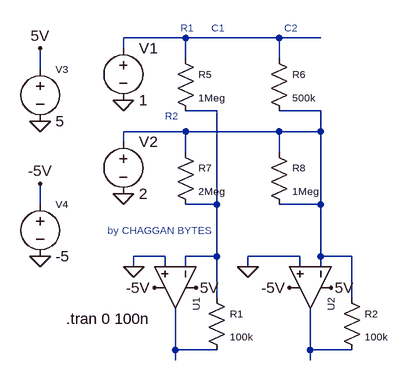
[diagram p0: schematic PIM_spice.asc]
PIM_spice.asc, the LTspice schematic file:
Version 4.1
SHEET 1 880 680
WIRE 480 48 384 48
WIRE 624 48 480 48
WIRE 688 48 624 48
WIRE 384 64 384 48
WIRE 480 80 480 48
WIRE 624 80 624 48
WIRE 256 96 256 64
WIRE 528 160 480 160
WIRE 688 160 624 160
WIRE 480 192 384 192
WIRE 624 192 480 192
WIRE 688 192 688 160
WIRE 688 192 624 192
WIRE 384 208 384 192
WIRE 480 224 480 192
WIRE 624 224 624 192
WIRE 256 304 256 272
WIRE 528 304 528 160
WIRE 528 304 480 304
WIRE 688 304 688 192
WIRE 688 304 624 304
WIRE 448 384 400 384
WIRE 528 384 528 304
WIRE 528 384 480 384
WIRE 656 384 576 384
WIRE 688 384 688 304
WIRE 736 384 688 384
WIRE 400 400 400 384
WIRE 448 400 448 384
WIRE 480 400 480 384
WIRE 576 400 576 384
WIRE 656 400 656 384
WIRE 688 400 688 384
WIRE 528 448 528 384
WIRE 736 448 736 384
WIRE 464 528 464 464
WIRE 528 528 464 528
WIRE 672 528 672 464
WIRE 736 528 672 528
WIRE 464 544 464 528
WIRE 672 544 672 528
FLAG 384 144 0
FLAG 384 288 0
FLAG 400 400 0
FLAG 256 64 5V
FLAG 496 432 5V
FLAG 256 272 -5V
FLAG 432 432 -5V
FLAG 256 176 0
FLAG 256 384 0
FLAG 576 400 0
FLAG 704 432 5V
FLAG 640 432 -5V
SYMBOL res 464 64 R0
WINDOW 0 36 40 Left 1
WINDOW 3 36 76 Left 1
SYMATTR InstName R5
SYMATTR Value 1Meg
SYMBOL res 608 64 R0
WINDOW 0 36 40 Left 1
WINDOW 3 36 76 Left 1
SYMATTR InstName R6
SYMATTR Value 500k
SYMBOL res 464 208 R0
WINDOW 0 36 40 Left 1
WINDOW 3 36 76 Left 1
SYMATTR InstName R7
SYMATTR Value 2Meg
SYMBOL res 608 208 R0
WINDOW 0 36 40 Left 1
WINDOW 3 36 76 Left 1
SYMATTR InstName R8
SYMATTR Value 1Meg
SYMBOL voltage 384 48 R0
WINDOW 123 0 0 Left 0
WINDOW 39 0 0 Left 0
SYMATTR InstName V1
SYMATTR Value 1
SYMBOL voltage 384 192 R0
WINDOW 123 0 0 Left 0
WINDOW 39 0 0 Left 0
SYMATTR InstName V2
SYMATTR Value 2
SYMBOL OpAmps\\UniversalOpAmp2 464 432 R90
WINDOW 0 16 -32 Left 1
SYMATTR InstName U1
SYMBOL res 512 432 R0
WINDOW 0 36 40 Left 1
WINDOW 3 36 76 Left 1
SYMATTR InstName R1
SYMATTR Value 100k
SYMBOL voltage 256 80 R0
WINDOW 0 24 16 Left 1
WINDOW 123 0 0 Left 0
WINDOW 39 0 0 Left 0
SYMATTR InstName V3
SYMATTR Value 5
SYMBOL voltage 256 288 R0
WINDOW 0 24 16 Left 1
WINDOW 123 0 0 Left 0
WINDOW 39 0 0 Left 0
SYMATTR InstName V4
SYMATTR Value -5
SYMBOL OpAmps\\UniversalOpAmp2 672 432 R90
WINDOW 0 16 -32 Left 1
SYMATTR InstName U2
SYMBOL res 720 432 R0
WINDOW 0 36 40 Left 1
WINDOW 3 36 76 Left 1
SYMATTR InstName R2
SYMATTR Value 100k
TEXT 472 32 Left 1 ;R1
TEXT 448 168 Left 1 ;R2
TEXT 520 32 Left 1 ;C1
TEXT 632 32 Left 1 ;C2
TEXT 360 344 Left 1 ;by CHAGGAN BYTES
TEXT 296 480 Left 2 !.tran 0 100n

The netlist it stands for:
* PIM_spice.asc
R5 N001 N002 1Meg
R6 N001 N003 500k
R7 N003 N002 2Meg
R8 N003 N003 1Meg
V1 N001 0 1
V2 N003 0 2
X§U1 0 N002 5V -5V N004 level2 Avol=1Meg GBW=10Meg Slew=10Meg Ilimit=25m Rail=0 Vos=0 En=0 Enk=0 In=0 Ink=0 Rin=500Meg  ; pins In+ In- V+ V- OUT
R1 N002 N004 100k
V3 5V 0 5
V4 -5V 0 -5
X§U2 0 N003 5V -5V N005 level2 Avol=1Meg GBW=10Meg Slew=10Meg Ilimit=25m Rail=0 Vos=0 En=0 Enk=0 In=0 Ink=0 Rin=500Meg  ; pins In+ In- V+ V- OUT
R2 N003 N005 100k
* R1
* R2
* C1
* C2
* by CHAGGAN BYTES
.tran 0 100n
.lib UniversalOpAmp2.lib
.backanno
.end